# EAGLE schematic 2dolvlBUP (EAGLE 7.5.0)
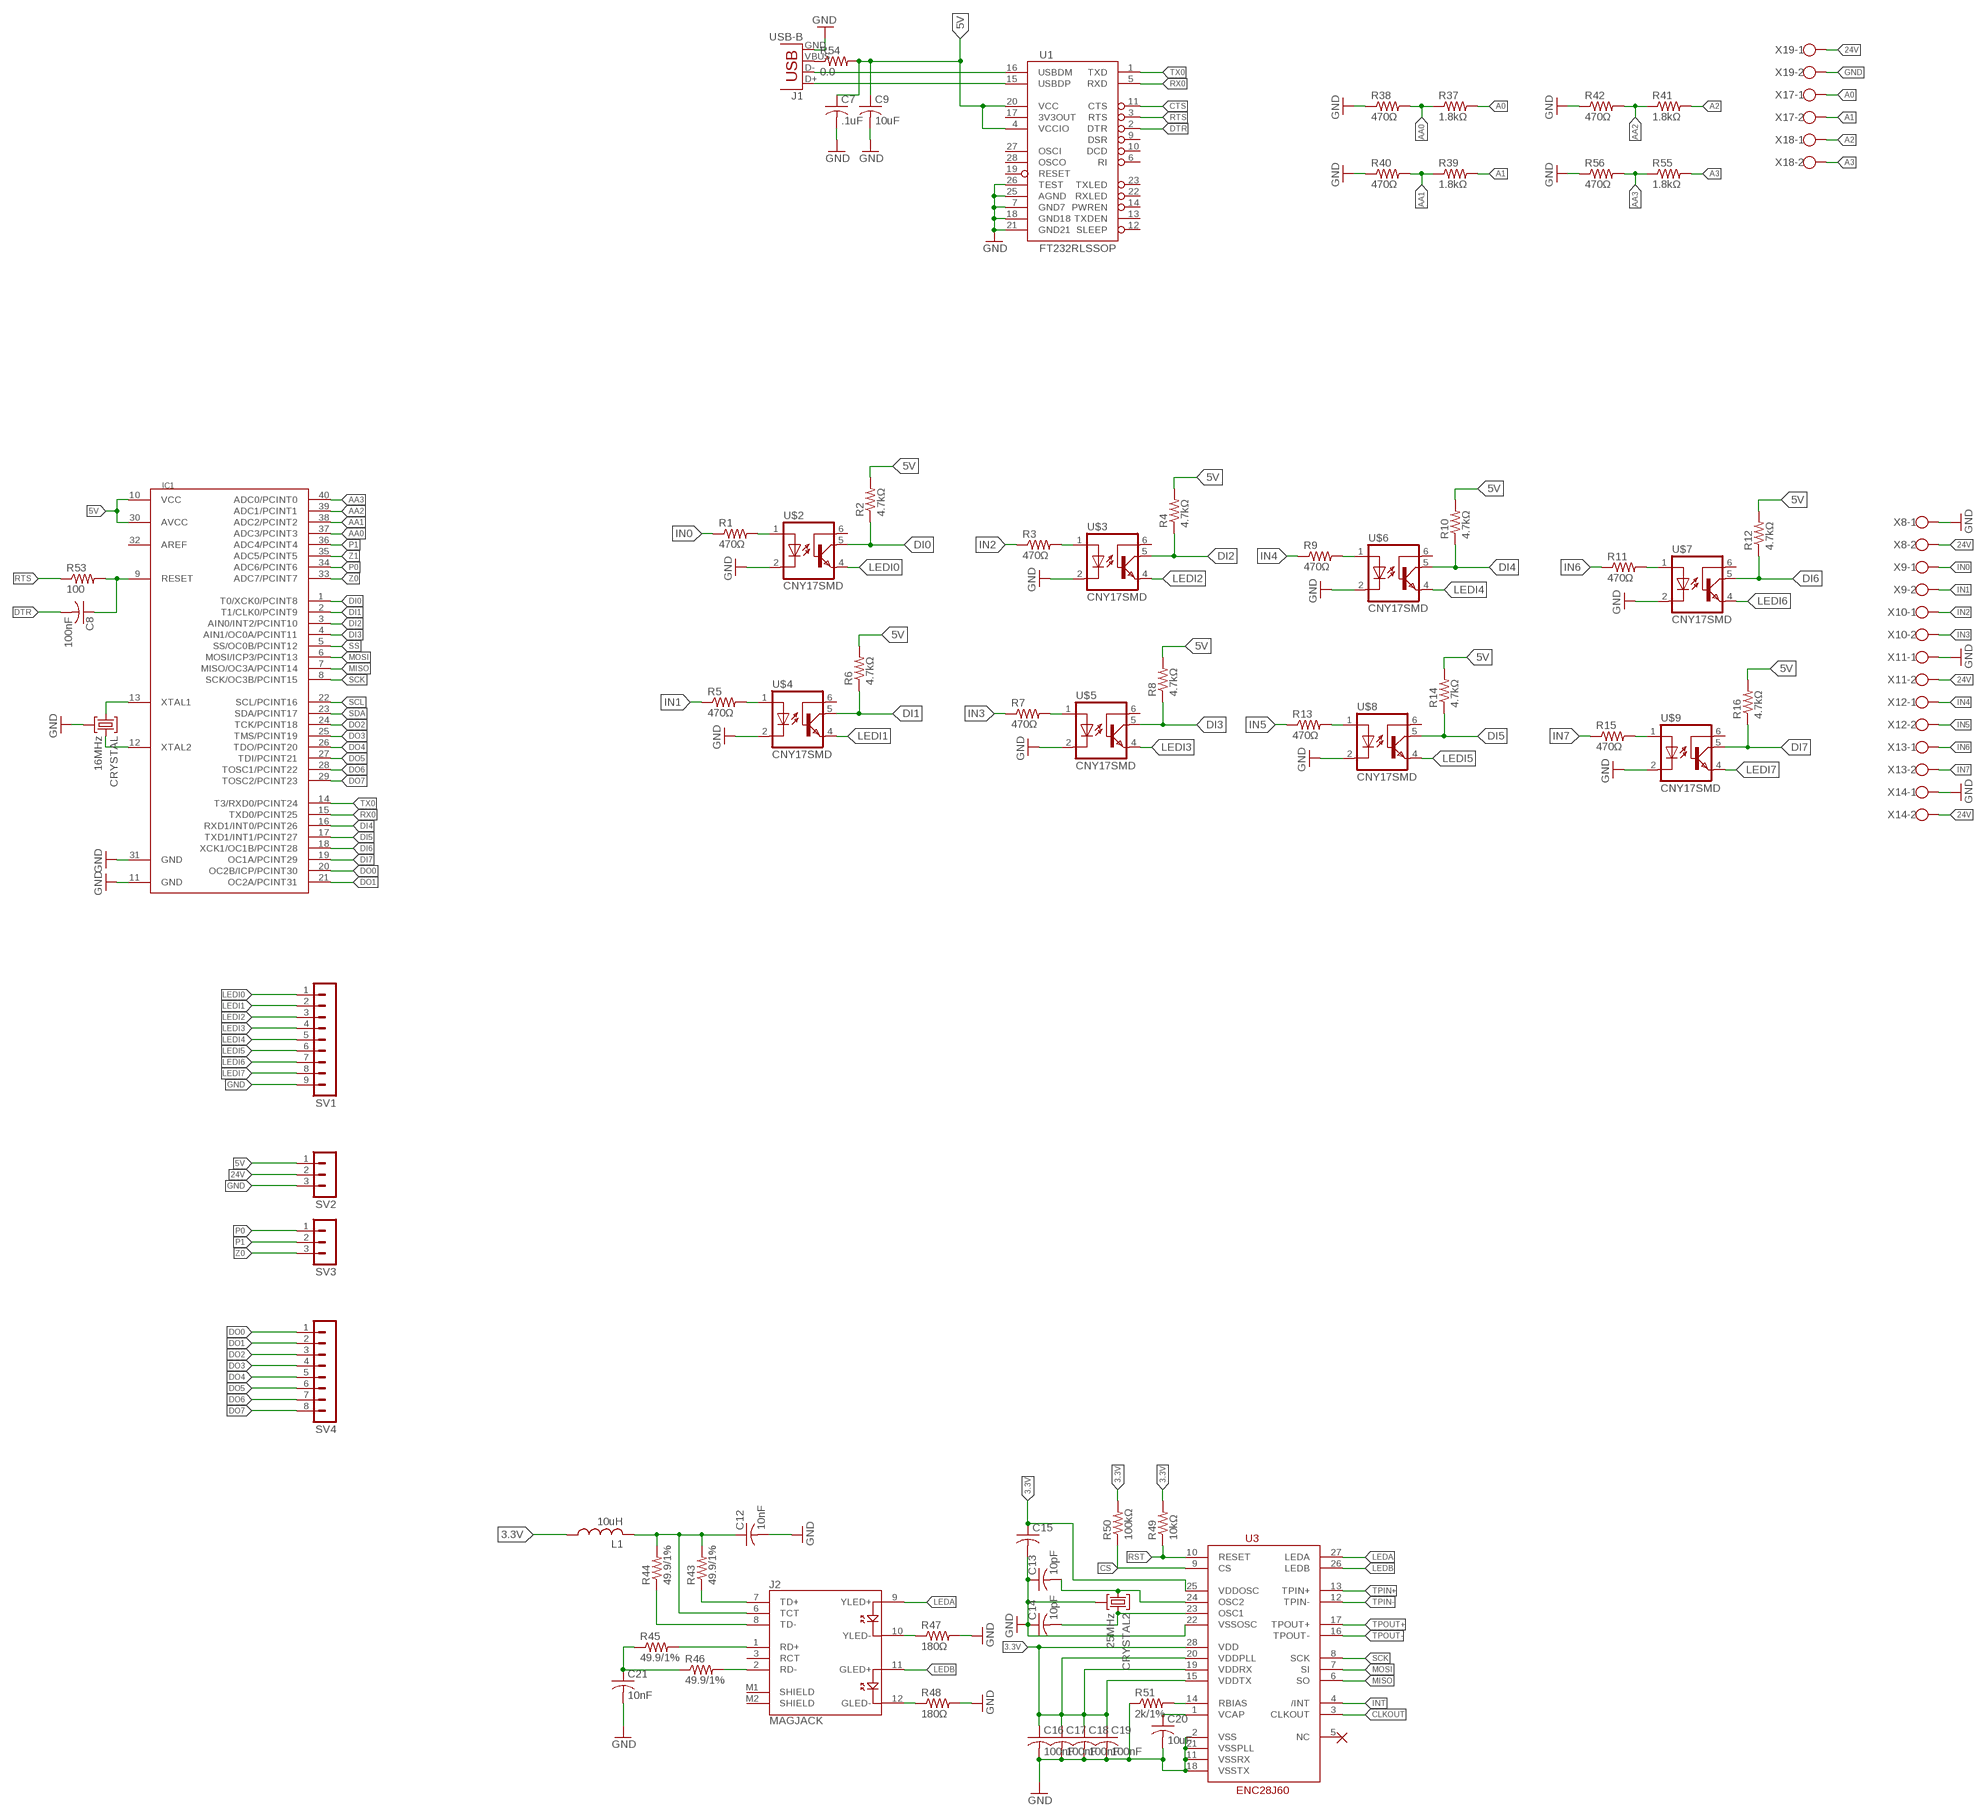
[diagram p0: schematic, sheet 1]

## Parts
C7  .1uF  C-USC0402K  [C0402K]
C8  100nF  C-US025-025X050  [C025-025X050]
C9  10uF  C-USC0805K  [C0805K]
C12  10nF  C-USC0402K  [C0402K]
C13  10pF  C-USC0603K  [C0603K]
C14  10pF  C-USC0603K  [C0603K]
C15  C-US025-025X050  [C025-025X050]
C16  100nF  C-US025-025X050  [C025-025X050]
C17  100nF  C-US025-025X050  [C025-025X050]
C18  100nF  C-US025-025X050  [C025-025X050]
C19  100nF  C-US025-025X050  [C025-025X050]
C20  10uF  C-USC0805K  [C0805K]
C21  10nF  C-USC0402K  [C0402K]
CRYSTAL  16MHz  SMDCRYSTAL  [SMDCRYSTAL]
CRYSTAL2  25MHz  SMDCRYSTAL  [SMDCRYSTAL]
IC1  MEGA1284P  [DIL40]
J1  USB-B  USBPTH  [USB-B-PTH]
J2  MAGJACK  [MAGJACK]
L1  10uH  L-US0204/7  [0204/7]
R1  470Ω  R-US_M0805  [M0805]
R2  4.7kΩ  R-US_M1206  [M1206]
R3  470Ω  R-US_M0805  [M0805]
R4  4.7kΩ  R-US_M1206  [M1206]
R5  470Ω  R-US_M0805  [M0805]
R6  4.7kΩ  R-US_M1206  [M1206]
R7  470Ω  R-US_M0805  [M0805]
R8  4.7kΩ  R-US_M1206  [M1206]
R9  470Ω  R-US_M0805  [M0805]
R10  4.7kΩ  R-US_M1206  [M1206]
R11  470Ω  R-US_M0805  [M0805]
R12  4.7kΩ  R-US_M1206  [M1206]
R13  470Ω  R-US_M0805  [M0805]
R14  4.7kΩ  R-US_M1206  [M1206]
R15  470Ω  R-US_M0805  [M0805]
R16  4.7kΩ  R-US_M1206  [M1206]
R37  1.8kΩ  R-US_M0805  [M0805]
R38  470Ω  R-US_M0805  [M0805]
R39  1.8kΩ  R-US_M0805  [M0805]
R40  470Ω  R-US_M0805  [M0805]
R41  1.8kΩ  R-US_M0805  [M0805]
R42  470Ω  R-US_M0805  [M0805]
R43  49.9/1%  R-US_R0402  [R0402]
R44  49.9/1%  R-US_R0402  [R0402]
R45  49.9/1%  R-US_R0402  [R0402]
R46  49.9/1%  R-US_R0402  [R0402]
R47  180Ω  R-US_M0805  [M0805]
R48  180Ω  R-US_M0805  [M0805]
R49  10kΩ  R-US_R0402  [R0402]
R50  100kΩ  R-US_R0603  [R0603]
R51  2k/1%  R-US_R0603  [R0603]
R53  100  RESISTOR1206  [1206]
R54  0.0  RESISTOR1206  [1206]
R55  1.8kΩ  R-US_M0805  [M0805]
R56  470Ω  R-US_M0805  [M0805]
SV1  MA09-1  [MA09-1]
SV2  MA03-1  [MA03-1]
SV3  MA03-1  [MA03-1]
SV4  MA08-1  [MA08-1]
U1  FT232RLSSOP  [SSOP28DB]
U3  ENC28J60  [SSOP28DB]
U$2  CNY17SMD  [DIL6-SMD]
U$3  CNY17SMD  [DIL6-SMD]
U$4  CNY17SMD  [DIL6-SMD]
U$5  CNY17SMD  [DIL6-SMD]
U$6  CNY17SMD  [DIL6-SMD]
U$7  CNY17SMD  [DIL6-SMD]
U$8  CNY17SMD  [DIL6-SMD]
U$9  CNY17SMD  [DIL6-SMD]
X8  W237-102  [W237-102]
X9  W237-102  [W237-102]
X10  W237-102  [W237-102]
X11  W237-102  [W237-102]
X12  W237-102  [W237-102]
X13  W237-102  [W237-102]
X14  W237-102  [W237-102]
X17  W237-102  [W237-102]
X18  W237-102  [W237-102]
X19  W237-102  [W237-102]

## Nets
3.3V: C15.1 C16.1 C17.1 C18.1 C19.1 L1.1 R49.2 R50.2 U3.15(VDDTX) U3.19(VDDRX) U3.20(VDDPLL) U3.25(VDDOSC) U3.28(VDD)
5V: C7.1 C9.1 IC1.10(VCC) IC1.30(AVCC) R2.2 R4.2 R6.2 R8.2 R10.2 R12.2 R14.2 R16.2 R54.2 SV2.1 U1.4(VCCIO) U1.20(VCC)
24V: SV2.2 X8.2 X11.2 X14.2 X19.1
A0: R37.2 X17.1
A1: R39.2 X17.2
A2: R41.2 X18.1
A3: R55.2 X18.2
AA0: IC1.37(ADC3/PCINT3) R37.1 R38.2
AA1: IC1.38(ADC2/PCINT2) R39.1 R40.2
AA2: IC1.39(ADC1/PCINT1) R41.1 R42.2
AA3: IC1.40(ADC0/PCINT0) R55.1 R56.2
CLKOUT: U3.3(CLKOUT)
CS: R50.1 U3.9(CS)
CTS: U1.11(CTS)
DI0: IC1.1(T0/XCK0/PCINT8) R2.1 U$2.5(COL)
DI1: IC1.2(T1/CLK0/PCINT9) R6.1 U$4.5(COL)
DI2: IC1.3(AIN0/INT2/PCINT10) R4.1 U$3.5(COL)
DI3: IC1.4(AIN1/OC0A/PCINT11) R8.1 U$5.5(COL)
DI4: IC1.16(RXD1/INT0/PCINT26) R10.1 U$6.5(COL)
DI5: IC1.17(TXD1/INT1/PCINT27) R14.1 U$8.5(COL)
DI6: IC1.18(XCK1/OC1B/PCINT28) R12.1 U$7.5(COL)
DI7: IC1.19(OC1A/PCINT29) R16.1 U$9.5(COL)
DO0: IC1.20(OC2B/ICP/PCINT30) SV4.1
DO1: IC1.21(OC2A/PCINT31) SV4.2
DO2: IC1.24(TCK/PCINT18) SV4.3
DO3: IC1.25(TMS/PCINT19) SV4.4
DO4: IC1.26(TDO/PCINT20) SV4.5
DO5: IC1.27(TDI/PCINT21) SV4.6
DO6: IC1.28(TOSC1/PCINT22) SV4.7
DO7: IC1.29(TOSC2/PCINT23) SV4.8
DTR: C8.2 U1.2(DTR)
GND: C7.2 C9.2 C12.2 C13.1 C14.1 C15.2 C16.2 C17.2 C18.2 C19.2 C20.2 C21.2 CRYSTAL2.GND CRYSTAL.GND IC1.11(GND) IC1.31(GND) J1.GND R38.1 R40.1 R42.1 R47.2 R48.2 R51.1 R56.1 SV1.9 SV2.3 U1.7(GND7) U1.18(GND18) U1.21(GND21) U1.25(AGND) U1.26(TEST) U3.2(VSS) U3.11(VSSRX) U3.18(VSSTX) U3.21(VSSPLL) U3.22(VSSOSC) U$2.2(C) U$3.2(C) U$4.2(C) U$5.2(C) U$6.2(C) U$7.2(C) U$8.2(C) U$9.2(C) X8.1 X11.1 X14.1 X19.2
IN0: R1.1 X9.1
IN1: R5.1 X9.2
IN2: R3.1 X10.1
IN3: R7.1 X10.2
IN4: R9.1 X12.1
IN5: R13.1 X12.2
IN6: R11.1 X13.1
IN7: R15.1 X13.2
INT: U3.4(/INT)
LEDA: J2.9(YLED+) U3.27(LEDA)
LEDB: J2.11(GLED+) U3.26(LEDB)
LEDI0: SV1.1 U$2.4(EMI)
LEDI1: SV1.2 U$4.4(EMI)
LEDI2: SV1.3 U$3.4(EMI)
LEDI3: SV1.4 U$5.4(EMI)
LEDI4: SV1.5 U$6.4(EMI)
LEDI5: SV1.6 U$8.4(EMI)
LEDI6: SV1.7 U$7.4(EMI)
LEDI7: SV1.8 U$9.4(EMI)
MISO: IC1.7(MISO/OC3A/PCINT14) U3.6(SO)
MOSI: IC1.6(MOSI/ICP3/PCINT13) U3.7(SI)
N$3: CRYSTAL.1 IC1.13(XTAL1)
N$8: CRYSTAL.2 IC1.12(XTAL2)
N$9: R1.2 U$2.1(A)
N$10: R3.2 U$3.1(A)
N$11: R5.2 U$4.1(A)
N$12: R7.2 U$5.1(A)
N$13: R9.2 U$6.1(A)
N$14: R11.2 U$7.1(A)
N$15: R13.2 U$8.1(A)
N$16: R15.2 U$9.1(A)
N$36: J1.D- U1.16(USBDM)
N$37: J1.D+ U1.15(USBDP)
N$49: J2.7(TD+) R43.1
N$50: J2.8(TD-) R44.1
N$51: C12.1 J2.6(TCT) L1.2 R43.2 R44.2
N$52: J2.2(RD-) R46.2
N$53: J2.1(RD+) R45.2
N$54: C13.2 CRYSTAL2.1 U3.24(OSC2)
N$55: J2.10(YLED-) R47.1
N$56: J2.12(GLED-) R48.1
N$58: C14.2 CRYSTAL2.2 U3.23(OSC1)
N$59: C21.1 R45.1 R46.1
N$60: C8.1 IC1.9(RESET) R53.2
N$61: C20.1 U3.1(VCAP)
N$62: R51.2 U3.14(RBIAS)
N$63: J1.VBUS R54.1
P0: IC1.34(ADC6/PCINT6) SV3.1
P1: IC1.36(ADC4/PCINT4) SV3.2
RST: R49.1 U3.10(RESET)
RTS: R53.1 U1.3(RTS)
RX0: IC1.15(TXD0/PCINT25) U1.5(RXD)
SCK: IC1.8(SCK/OC3B/PCINT15) U3.8(SCK)
SCL: IC1.22(SCL/PCINT16)
SDA: IC1.23(SDA/PCINT17)
SS: IC1.5(SS/OC0B/PCINT12)
TPIN+: U3.13(TPIN+)
TPIN-: U3.12(TPIN-)
TPOUT+: U3.17(TPOUT+)
TPOUT-: U3.16(TPOUT-)
TX0: IC1.14(T3/RXD0/PCINT24) U1.1(TXD)
Z0: IC1.33(ADC7/PCINT7) SV3.3
Z1: IC1.35(ADC5/PCINT5)
Unconnected: IC1.32(AREF) J2.3(RCT) J2.M1(SHIELD) J2.M2(SHIELD) U1.6(RI) U1.9(DSR) U1.10(DCD) U1.12(SLEEP) U1.13(TXDEN) U1.14(PWREN) U1.17(3V3OUT) U1.19(RESET) U1.22(RXLED) U1.23(TXLED) U1.27(OSCI) U1.28(OSCO) U3.5(NC) U$2.6(BAS) U$3.6(BAS) U$4.6(BAS) U$5.6(BAS) U$6.6(BAS) U$7.6(BAS) U$8.6(BAS) U$9.6(BAS)

## Library data of the parts
C7-C9 C12-C21 = resistor:C-US: CAPACITOR, American symbol
CRYSTAL CRYSTAL2 = crystal:SMDCRYSTAL
IC1 = 1284p:MEGA1284P: Atmel ATmega1284P 8-bit AVR Microcontroller
J1 = SparkFun-Connectors:USB: USB Connectors USB-B-PTH is fully proven SKU : PRT-00139/CONN-08278 USB-miniB is fully proven SKU : PRT-00587 USB-A-PCB is untested. USB-A-H is throughly reviewed, but untested. Spark Fun Electronics SKU : PRT-00437 USB-B-SMT is throughly reviewed, but untested. Needs silkscreen touching up. USB-A-S has not been used/tested USB-MB-H has not been used/tested USB-MICROB has been used. CONN-09505; PROD_ID: CONN-08278
J2 = SparkFun-Connectors:MAGJACK: RJ-45 with LEDs
L1 = resistor:L-US: INDUCTOR, American symbol
R1-R16 R37-R51 R55 R56 = resistor:R-US_: RESISTOR, American symbol
R53 R54 = SparkFun-Resistors:RESISTOR: Resistor Basic schematic elements and footprints for 0603, 1206, and PTH resistors.
SV1 = con-lstb:MA09-1: PIN HEADER; OC_FARNELL: unknown; OC_NEWARK: unknown
SV2 SV3 = con-lstb:MA03-1: PIN HEADER; OC_FARNELL: unknown; OC_NEWARK: unknown
SV4 = con-lstb:MA08-1: PIN HEADER; OC_FARNELL: unknown; OC_NEWARK: unknown
U1 = SparkFun-DigitalIC:FT232RL: USB UART FT232RL 4th Generation USB UART (USB <-> Serial) Controller. Spark Fun Electronics SKU : COM-00650 Production SKU IC-00870; PROD_ID: IC-00870
U3 = SparkFun-DigitalIC:ENC28J60: Microchip SPI 10Base ethernet IC
U$2-U$9 = optocoupler:CNY17SMD
X8-X14 X17-X19 = con-wago-500:W237-102: WAGO SCREW CLAMP; MPN: 237-102; OC_FARNELL: unknown; OC_NEWARK: 70K9898